# Altium schematic sheet Voltage supply & reference.SchDoc
size A
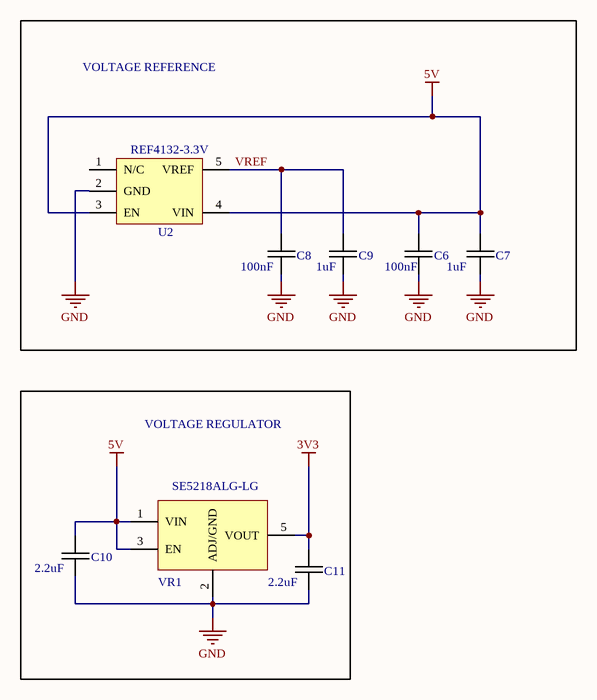
[diagram p0: Voltage supply & reference.SchDoc]

## Parts
C6  100nF  [0603C]
C7  1uF  [0603C]
C8  100nF  [0603C]
C9  1uF  [0603C]
C10  2.2uF  [0603C]
C11  2.2uF  [0603C]
U2  REF4132-3.3V  [SOT-23-5]
VR1  SE5218ALG-LG  [SOT-23-5]

## Blocks framed on the sheet
VOLTAGE REFERENCE: C6-C9 U2
VOLTAGE REGULATOR: C10 C11 VR1

## Nets
3V3: C11.2 VR1.5(VOUT)
5V: C6.2 C7.2 C10.2 U2.3(EN) U2.4(VIN) VR1.1(VIN) VR1.3(EN)
GND: C6.1 C7.1 C8.1 C9.1 C10.1 C11.1 U2.2(GND) VR1.2(ADJ/GND)
VREF: C8.2 C9.2 U2.5(VREF)

Not connected (* = marked no-connect by the designer): U2 1(N/C)

## Library data of the parts
C6-C11 = 0603C
VR1 = VREG 3V3